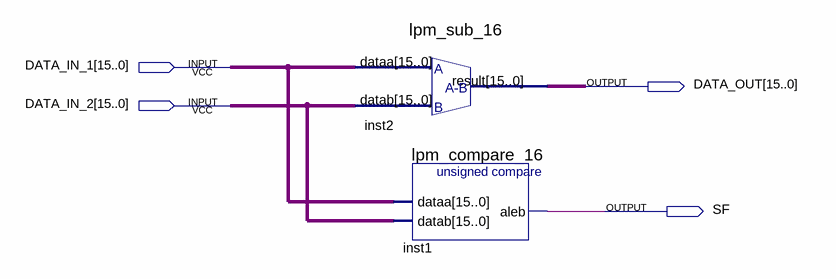
[diagram p0: schematic sheet]
// Quartus schematic oper_sub.bdf as structural Verilog: 2 symbols, 4 pins
module oper_sub (
  input  [15:0] DATA_IN_1,
  input  [15:0] DATA_IN_2,
  output [15:0] DATA_OUT,
  output SF
);

  lpm_sub_16 inst2 (.dataa(DATA_IN_1), .datab(DATA_IN_2), .result(DATA_OUT));
  lpm_compare_16 inst1 (.dataa(DATA_IN_1), .datab(DATA_IN_2), .aleb(SF));
endmodule
